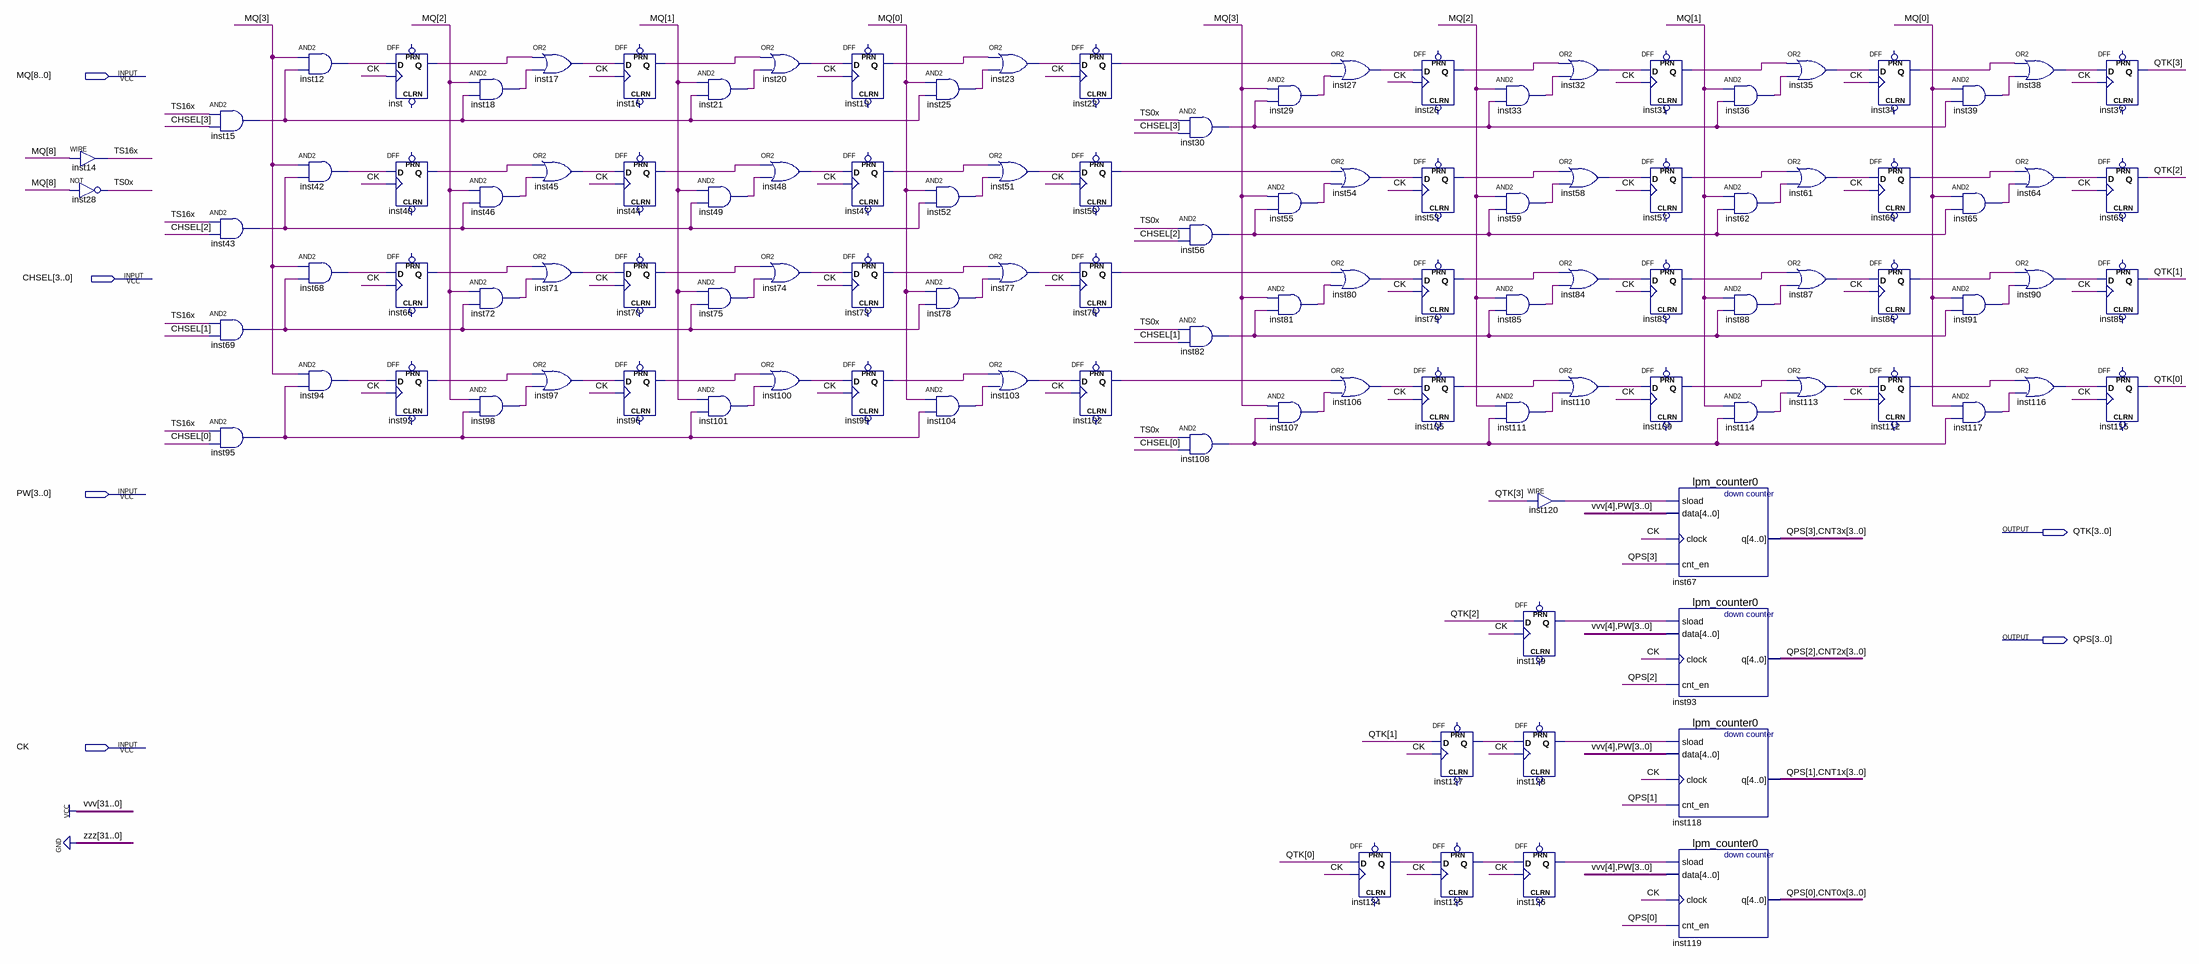
[diagram p0: schematic sheet]
// Quartus schematic ChTK4nsOut.bdf as structural Verilog: 113 symbols, 6 pins
module ChTK4nsOut (
  input  [8:0] MQ,
  input  [3:0] CHSEL,
  input  [3:0] PW,
  input  CK,
  output [3:0] QTK,
  output [3:0] QPS
);

  wire inst12_out, inst15_out, inst16_q, inst17_out, inst18_out, inst19_q, inst20_out, inst21_out, inst22_q,
       inst23_out, inst25_out, inst26_q, inst27_out, inst29_out, inst30_out, inst31_q, inst32_out,
       inst33_out, inst34_q, inst35_out, inst36_out, inst38_out, inst39_out, inst40_q, inst42_out,
       inst43_out, inst44_q, inst45_out, inst46_out, inst47_q, inst48_out, inst49_out, inst50_q, inst51_out,
       inst52_out, inst53_q, inst54_out, inst55_out, inst56_out, inst57_q, inst58_out, inst59_out, inst60_q,
       inst61_out, inst62_out, inst64_out, inst65_out, inst66_q, inst68_out, inst69_out, inst70_q,
       inst71_out, inst72_out, inst73_q, inst74_out, inst75_out, inst76_q, inst77_out, inst78_out, inst79_q,
       inst80_out, inst81_out, inst82_out, inst83_q, inst84_out, inst85_out, inst86_q, inst87_out,
       inst88_out, inst90_out, inst91_out, inst92_q, inst94_out, inst95_out, inst96_q, inst97_out,
       inst98_out, inst99_q, inst100_out, inst101_out, inst102_q, inst103_out, inst104_out, inst105_q,
       inst106_out, inst107_out, inst108_out, inst109_q, inst110_out, inst111_out, inst112_q, inst113_out,
       inst114_out, inst116_out, inst117_out, inst120_out, inst124_q, inst125_q, inst126_q, inst127_q,
       inst128_q, inst129_q, inst_q, TS0x, TS16x;
  wire [3:0] CNT0x, CNT1x, CNT2x, CNT3x;

  assign TS16x = MQ[8];  // WIRE inst14
  not inst28 (TS0x, MQ[8]);
  and inst15 (inst15_out, TS16x, CHSEL[3]);
  and inst43 (inst43_out, TS16x, CHSEL[2]);
  and inst69 (inst69_out, TS16x, CHSEL[1]);
  and inst95 (inst95_out, TS16x, CHSEL[0]);
  and inst12 (inst12_out, MQ[3], inst15_out);
  and inst42 (inst42_out, MQ[3], inst43_out);
  and inst68 (inst68_out, MQ[3], inst69_out);
  and inst94 (inst94_out, MQ[3], inst95_out);
  DFF inst (.CLK(CK), .D(inst12_out), .Q(inst_q));  // open: CLRN, PRN
  DFF inst40 (.CLK(CK), .D(inst42_out), .Q(inst40_q));  // open: CLRN, PRN
  DFF inst66 (.CLK(CK), .D(inst68_out), .Q(inst66_q));  // open: CLRN, PRN
  DFF inst92 (.CLK(CK), .D(inst94_out), .Q(inst92_q));  // open: CLRN, PRN
  and inst18 (inst18_out, MQ[2], inst15_out);
  and inst46 (inst46_out, MQ[2], inst43_out);
  and inst72 (inst72_out, MQ[2], inst69_out);
  and inst98 (inst98_out, MQ[2], inst95_out);
  or inst17 (inst17_out, inst_q, inst18_out);
  or inst45 (inst45_out, inst40_q, inst46_out);
  or inst71 (inst71_out, inst66_q, inst72_out);
  or inst97 (inst97_out, inst92_q, inst98_out);
  DFF inst16 (.CLK(CK), .D(inst17_out), .Q(inst16_q));  // open: CLRN, PRN
  DFF inst44 (.CLK(CK), .D(inst45_out), .Q(inst44_q));  // open: CLRN, PRN
  DFF inst70 (.CLK(CK), .D(inst71_out), .Q(inst70_q));  // open: CLRN, PRN
  DFF inst96 (.CLK(CK), .D(inst97_out), .Q(inst96_q));  // open: CLRN, PRN
  and inst21 (inst21_out, MQ[1], inst15_out);
  and inst49 (inst49_out, MQ[1], inst43_out);
  and inst75 (inst75_out, MQ[1], inst69_out);
  and inst101 (inst101_out, MQ[1], inst95_out);
  or inst20 (inst20_out, inst16_q, inst21_out);
  or inst48 (inst48_out, inst44_q, inst49_out);
  or inst74 (inst74_out, inst70_q, inst75_out);
  or inst100 (inst100_out, inst96_q, inst101_out);
  DFF inst19 (.CLK(CK), .D(inst20_out), .Q(inst19_q));  // open: CLRN, PRN
  DFF inst47 (.CLK(CK), .D(inst48_out), .Q(inst47_q));  // open: CLRN, PRN
  DFF inst73 (.CLK(CK), .D(inst74_out), .Q(inst73_q));  // open: CLRN, PRN
  DFF inst99 (.CLK(CK), .D(inst100_out), .Q(inst99_q));  // open: CLRN, PRN
  and inst25 (inst25_out, MQ[0], inst15_out);
  and inst52 (inst52_out, MQ[0], inst43_out);
  and inst78 (inst78_out, MQ[0], inst69_out);
  and inst104 (inst104_out, MQ[0], inst95_out);
  or inst23 (inst23_out, inst19_q, inst25_out);
  or inst51 (inst51_out, inst47_q, inst52_out);
  or inst77 (inst77_out, inst73_q, inst78_out);
  or inst103 (inst103_out, inst99_q, inst104_out);
  DFF inst22 (.CLK(CK), .D(inst23_out), .Q(inst22_q));  // open: CLRN, PRN
  DFF inst50 (.CLK(CK), .D(inst51_out), .Q(inst50_q));  // open: CLRN, PRN
  DFF inst76 (.CLK(CK), .D(inst77_out), .Q(inst76_q));  // open: CLRN, PRN
  DFF inst102 (.CLK(CK), .D(inst103_out), .Q(inst102_q));  // open: CLRN, PRN
  and inst30 (inst30_out, TS0x, CHSEL[3]);
  and inst56 (inst56_out, TS0x, CHSEL[2]);
  and inst82 (inst82_out, TS0x, CHSEL[1]);
  and inst108 (inst108_out, TS0x, CHSEL[0]);
  and inst29 (inst29_out, MQ[3], inst30_out);
  and inst55 (inst55_out, MQ[3], inst56_out);
  and inst81 (inst81_out, MQ[3], inst82_out);
  and inst107 (inst107_out, MQ[3], inst108_out);
  or inst27 (inst27_out, inst22_q, inst29_out);
  or inst54 (inst54_out, inst50_q, inst55_out);
  or inst80 (inst80_out, inst76_q, inst81_out);
  or inst106 (inst106_out, inst102_q, inst107_out);
  DFF inst124 (.CLK(CK), .D(QTK[0]), .Q(inst124_q));  // open: CLRN, PRN
  DFF inst26 (.CLK(CK), .D(inst27_out), .Q(inst26_q));  // open: CLRN, PRN
  DFF inst53 (.CLK(CK), .D(inst54_out), .Q(inst53_q));  // open: CLRN, PRN
  DFF inst79 (.CLK(CK), .D(inst80_out), .Q(inst79_q));  // open: CLRN, PRN
  DFF inst105 (.CLK(CK), .D(inst106_out), .Q(inst105_q));  // open: CLRN, PRN
  DFF inst127 (.CLK(CK), .D(QTK[1]), .Q(inst127_q));  // open: CLRN, PRN
  DFF inst125 (.CLK(CK), .D(inst124_q), .Q(inst125_q));  // open: CLRN, PRN
  and inst33 (inst33_out, MQ[2], inst30_out);
  and inst59 (inst59_out, MQ[2], inst56_out);
  and inst85 (inst85_out, MQ[2], inst82_out);
  and inst111 (inst111_out, MQ[2], inst108_out);
  assign inst120_out = QTK[3];  // WIRE inst120
  DFF inst129 (.CLK(CK), .D(QTK[2]), .Q(inst129_q));  // open: CLRN, PRN
  DFF inst128 (.CLK(CK), .D(inst127_q), .Q(inst128_q));  // open: CLRN, PRN
  DFF inst126 (.CLK(CK), .D(inst125_q), .Q(inst126_q));  // open: CLRN, PRN
  or inst32 (inst32_out, inst26_q, inst33_out);
  or inst58 (inst58_out, inst53_q, inst59_out);
  or inst84 (inst84_out, inst79_q, inst85_out);
  or inst110 (inst110_out, inst105_q, inst111_out);
  DFF inst31 (.CLK(CK), .D(inst32_out), .Q(inst31_q));  // open: CLRN, PRN
  DFF inst57 (.CLK(CK), .D(inst58_out), .Q(inst57_q));  // open: CLRN, PRN
  DFF inst83 (.CLK(CK), .D(inst84_out), .Q(inst83_q));  // open: CLRN, PRN
  DFF inst109 (.CLK(CK), .D(inst110_out), .Q(inst109_q));  // open: CLRN, PRN
  lpm_counter0 inst67 (.sload(inst120_out), .data({1'b1, PW}), .clock(CK), .cnt_en(QPS[3]), .q({QPS[3], CNT3x}));
  lpm_counter0 inst93 (.sload(inst129_q), .data({1'b1, PW}), .clock(CK), .cnt_en(QPS[2]), .q({QPS[2], CNT2x}));
  lpm_counter0 inst118 (.sload(inst128_q), .data({1'b1, PW}), .clock(CK), .cnt_en(QPS[1]), .q({QPS[1], CNT1x}));
  lpm_counter0 inst119 (.sload(inst126_q), .data({1'b1, PW}), .clock(CK), .cnt_en(QPS[0]), .q({QPS[0], CNT0x}));
  and inst36 (inst36_out, MQ[1], inst30_out);
  and inst62 (inst62_out, MQ[1], inst56_out);
  and inst88 (inst88_out, MQ[1], inst82_out);
  and inst114 (inst114_out, MQ[1], inst108_out);
  or inst35 (inst35_out, inst31_q, inst36_out);
  or inst61 (inst61_out, inst57_q, inst62_out);
  or inst87 (inst87_out, inst83_q, inst88_out);
  or inst113 (inst113_out, inst109_q, inst114_out);
  DFF inst34 (.CLK(CK), .D(inst35_out), .Q(inst34_q));  // open: CLRN, PRN
  DFF inst60 (.CLK(CK), .D(inst61_out), .Q(inst60_q));  // open: CLRN, PRN
  DFF inst86 (.CLK(CK), .D(inst87_out), .Q(inst86_q));  // open: CLRN, PRN
  DFF inst112 (.CLK(CK), .D(inst113_out), .Q(inst112_q));  // open: CLRN, PRN
  and inst39 (inst39_out, MQ[0], inst30_out);
  and inst65 (inst65_out, MQ[0], inst56_out);
  and inst91 (inst91_out, MQ[0], inst82_out);
  and inst117 (inst117_out, MQ[0], inst108_out);
  or inst38 (inst38_out, inst34_q, inst39_out);
  or inst64 (inst64_out, inst60_q, inst65_out);
  or inst90 (inst90_out, inst86_q, inst91_out);
  or inst116 (inst116_out, inst112_q, inst117_out);
  DFF inst37 (.CLK(CK), .D(inst38_out), .Q(QTK[3]));  // open: CLRN, PRN
  DFF inst63 (.CLK(CK), .D(inst64_out), .Q(QTK[2]));  // open: CLRN, PRN
  DFF inst89 (.CLK(CK), .D(inst90_out), .Q(QTK[1]));  // open: CLRN, PRN
  DFF inst115 (.CLK(CK), .D(inst116_out), .Q(QTK[0]));  // open: CLRN, PRN
endmodule
